# EAGLE design ArduinoNanoTemplateShield (EAGLE 7.2.0)
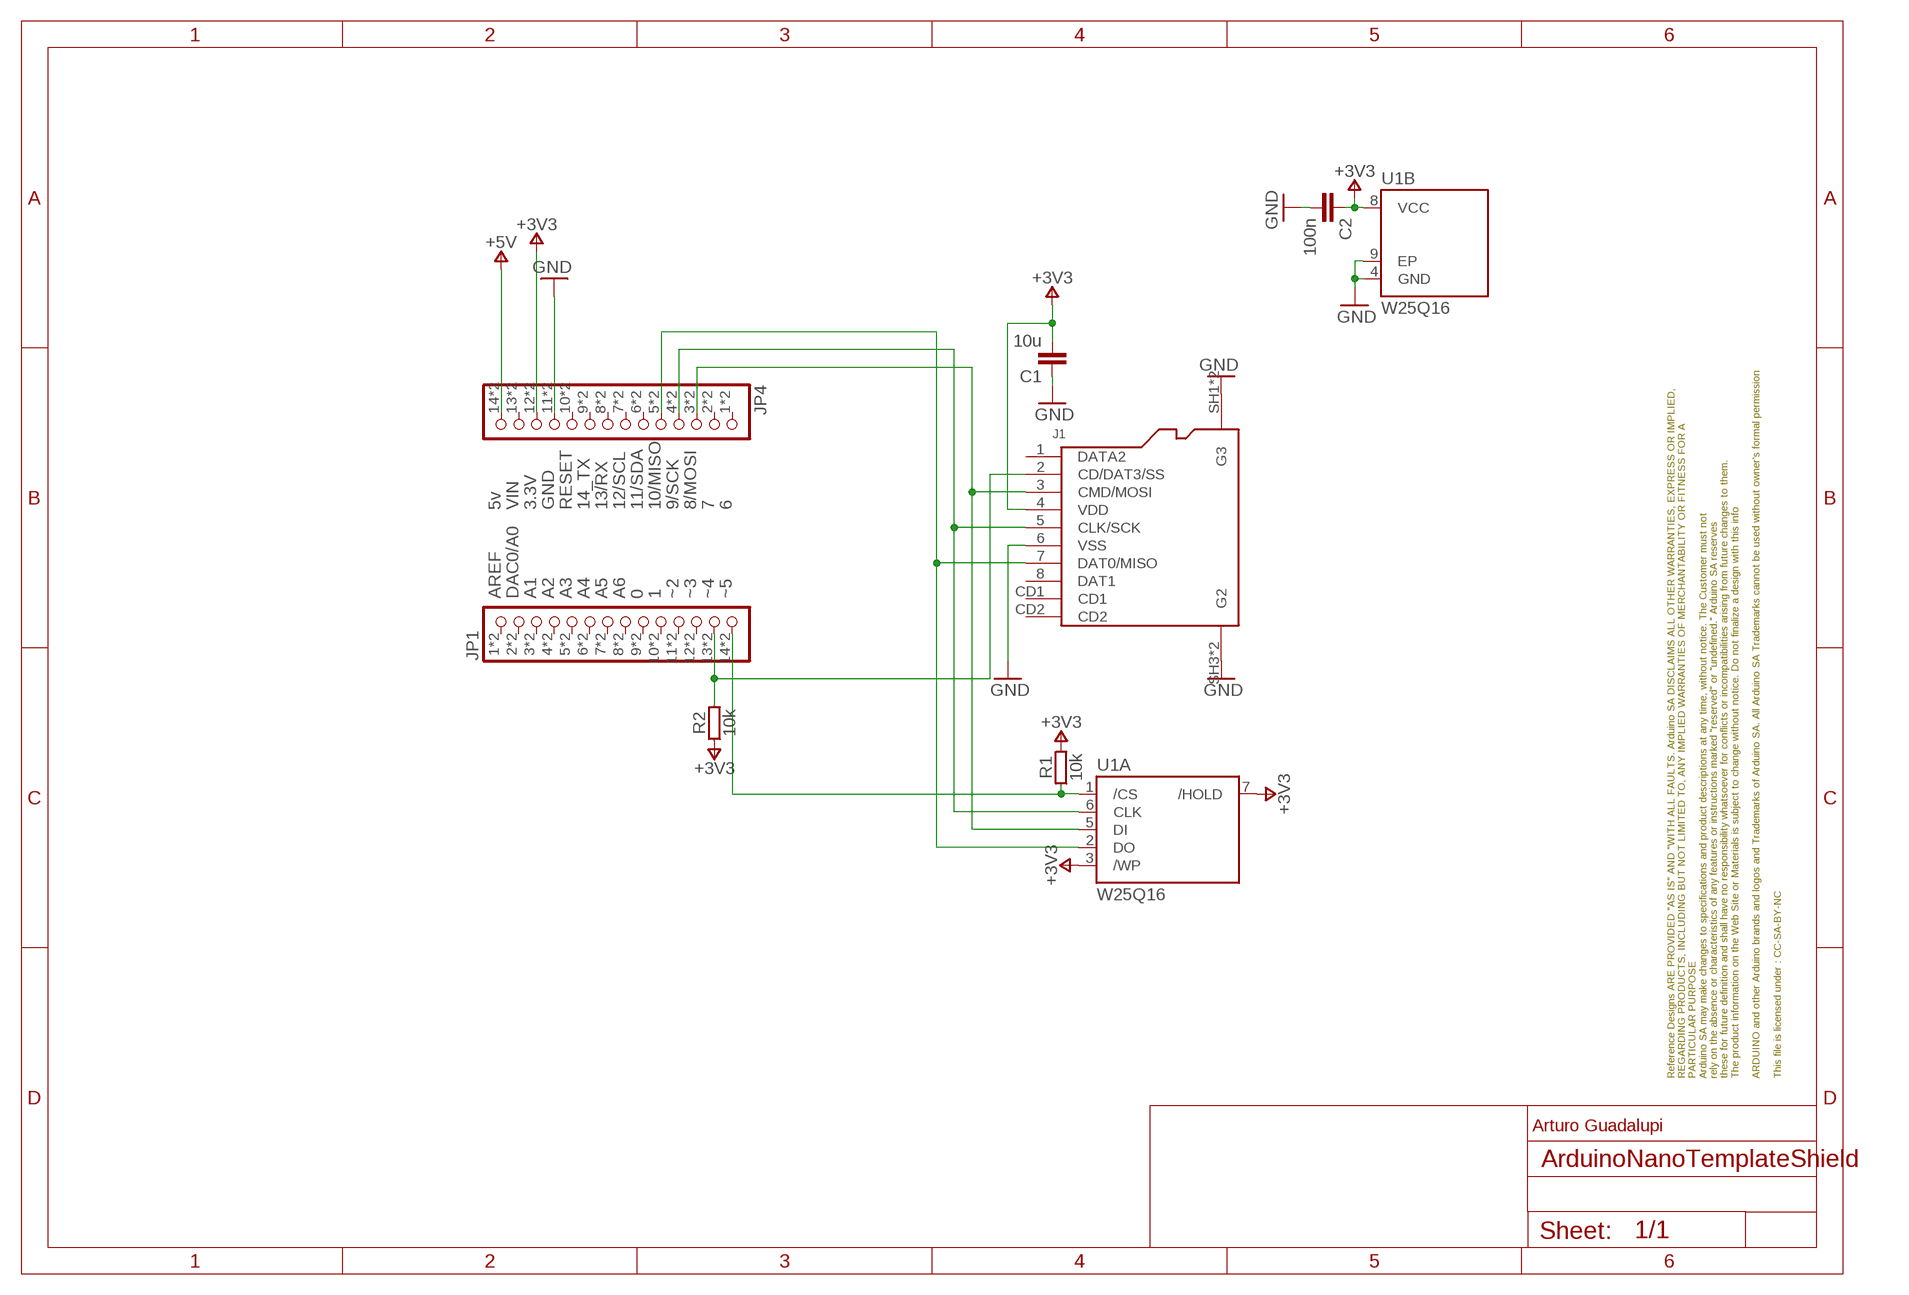
[diagram p0: schematic, sheet 1]

## Parts
C1  10u  C-10UF-0603  [0603-1608X90N]
C2  100n  C-100NF-0603  [0603-1608X90N]
FRAME1  DNP  A4L-LOC  [FRAME]
J1  -  SD_AMPHENOL  [AMPHENOL_114-00841-68]
JP1  -  PINHD-1X14TH-DOUBLE  [1X14-DOUBLE]
JP4  -  PINHD-1X14TH-DOUBLE  [1X14-DOUBLE]
R1  10k  R-10K-0603  [C0603]
R2  10k  R-10K-0603  [C0603]
U1  W25Q16  W25Q16DVZPIG  [SON9P127_500X600X80L60X41T340X400N]

## Nets
+3V3: C1.2 C2.1 J1.4(VDD) JP4.12 JP4.26 R1.2 R2.1 U1.3(A:/WP) U1.7(A:/HOLD) U1.8(B:VCC)
+5V: JP4.14 JP4.28
GND: C1.1 C2.2 J1.6(VSS) J1.SH1(G3) J1.SH2(G3) J1.SH3(G2) J1.SH4(G2) JP4.11 JP4.25 U1.4(B:GND) U1.9(B:EP)
N$1: JP1.14 JP1.28 R1.1 U1.1(A:/CS)
N$3: J1.3(CMD/MOSI) JP4.3 JP4.17 U1.5(A:DI)
N$4: J1.5(CLK/SCK) JP4.4 JP4.18 U1.6(A:CLK)
N$5: J1.7(DAT0/MISO) JP4.5 JP4.19 U1.2(A:DO)
N$77: J1.2(CD/DAT3/SS) JP1.13 JP1.27 R2.2
Unconnected: J1.1(DATA2) J1.8(DAT1) J1.CD1 J1.CD2 JP1.1 JP1.2 JP1.3 JP1.4 JP1.5 JP1.6 JP1.7 JP1.8 JP1.9 JP1.10 JP1.11 JP1.12 JP1.15 JP1.16 JP1.17 JP1.18 JP1.19 JP1.20 JP1.21 JP1.22 JP1.23 JP1.24 JP1.25 JP1.26 JP4.1 JP4.2 JP4.6 JP4.7 JP4.8 JP4.9 JP4.10 JP4.13 JP4.15 JP4.16 JP4.20 JP4.21 JP4.22 JP4.23 JP4.24 JP4.27

## Notes on the sheet
- 5v | VIN | 3.3V | GND | RESET | 14_TX | 13/RX | 12/SCL | 11/SDA | 10/MISO | 9/SCK | 8/MOSI | 7 | 6
- AREF | DAC0/A0 | A1 | A2 | A3 | A4 | A5 | A6 | 0 | 1 | ~2 | ~3 | ~4 | ~5
- Arturo Guadalupi

## Library data of the parts
C1 = Arduino-rcl:C: SMD Capacitor; CODE-BCE: -; CODE-BCMI: -; CODE-TK2: -; DATASHEET: http://www.murata.com/~/media/webrenewal/support/library/catalog/products/capacitor/mlcc/c02e.pdf; DISTRIBUTOR-LINK: http://www.digikey.com/product-search/en?keywords=490-10728-1-ND; DISTRIBUTOR-PN: 490-10728-1-ND; MANUFACTURER: Murata; MANUFACTURER-PN: GRM188R61C106KAALD
C2 = Arduino-rcl:C: SMD Capacitor; CODE-BCE: SP0015; CODE-BCMI: 0015; CODE-TK2: CL10B104KB8NNNC; DATASHEET: http://search.murata.co.jp/Ceramy/image/img/A01X/G101/ENG/GRM188R71C104KA01-01.pdf; DISTRIBUTOR-LINK: https://www.digikey.com/product-detail/en/murata-electronics-north-america/GRM188R71C104KA01D/490-1532-1-ND/587771; DISTRIBUTOR-PN: 490-1532-2-ND; MANUFACTURER: Murata; MANUFACTURER-PN: GRM188R71C104KA01D
FRAME1 = Arduino-utility:A4L-LOC: FRAME DIN A4, landscape with location and doc. field; CODE-ARDUINO: DNP; DATASHEET: DNP; DISTRIBUTOR-LINK: DNP; DISTRIBUTOR-PN: DNP; MANUFACTURER: DNP; MANUFACTURER-PN: DNP
J1 = Arduino-connectors:SD_AMPHENOL: Micro SD connector; CODE-BCE: -; CODE-TK2: -; DATASHEET: https://www.amphenolcanada.com/ProductSearch/drawings/AC/1140084168.pdf; DISTRIBUTOR-LINK: http://www.digikey.com/product-detail/en/amphenol-commercial-products/114-00841-68/114-00841-68-1-ND/2187101; DISTRIBUTOR-PN: 114-00841-68-1-ND; MANUFACTURER: Amphenol; MANUFACTURER-PN: 114-00841-68
JP1 JP4 = Arduino-connectors:PINHD-1X14: PIN HEADER; CODE-BCE: -; CODE-TK2: -; DATASHEET: -; DISTRIBUTOR-LINK: -; DISTRIBUTOR-PN: -; MANUFACTURER: ELDECO; MANUFACTURER-PN: FH254114DF08500T
R1 R2 = Arduino-rcl:R: SMD Resistor; CODE-BCE: SP0899; CODE-BCMI: 0899; CODE-TK2: -; DATASHEET: http://www.yageo.com/documents/recent/PYu-RC_Group_51_RoHS_L_8.pdf; DISTRIBUTOR-LINK: https://www.digikey.com/product-detail/en/yageo/RC0603JR-0710KL/311-10KGRCT-ND/729647; DISTRIBUTOR-PN: 311-10KGRCT-ND; MANUFACTURER: Yageo; MANUFACTURER-PN: RC0603JR-0710KL
U1 = Arduino-ICs:W25Q*: Flash; CODE-BCE: -; CODE-TK2: -; DATASHEET: https://www.winbond.com/resource-files/w25q16jv%20spi%20revd%2008122016.pdf; DISTRIBUTOR-LINK: https://www.digikey.com/product-detail/it/winbond-electronics/W25Q16JVZPIQ/W25Q16JVZPIQ-ND/6193770; DISTRIBUTOR-PN: W25Q16JVZPIQ-ND; MANUFACTURER: Winbond; MANUFACTURER-PN: W25Q16JVZPIQ

## Board
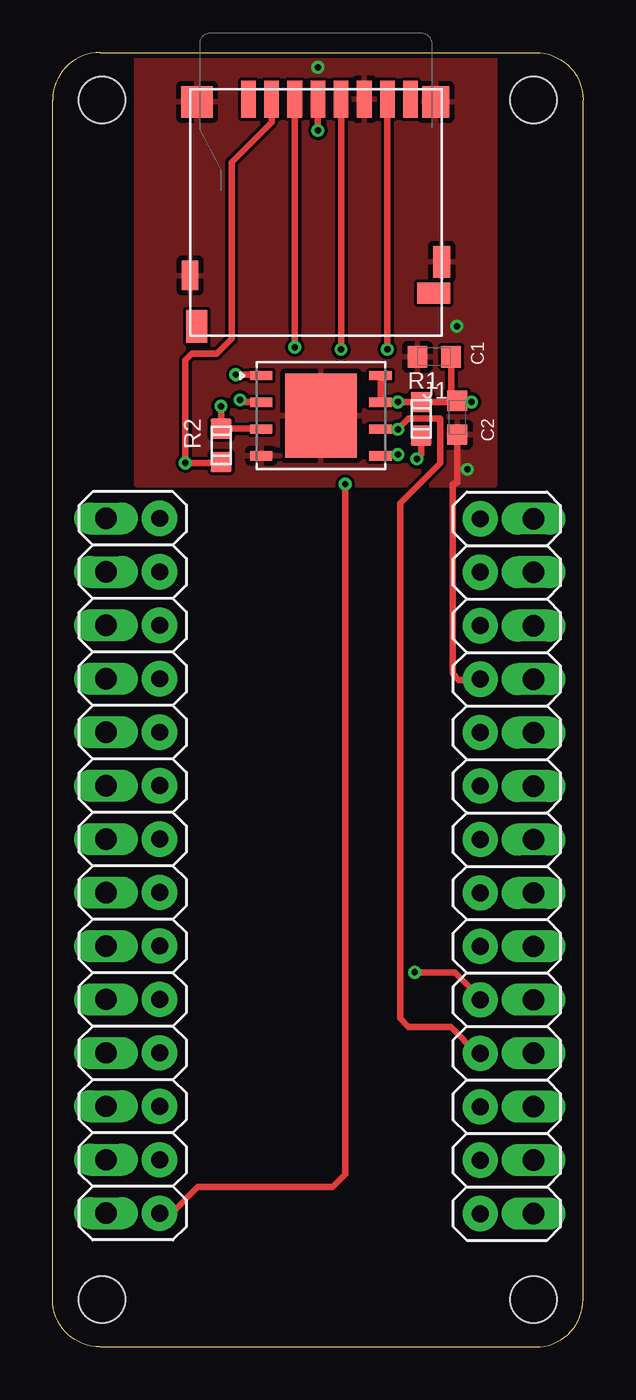
[diagram p1: board, top side]
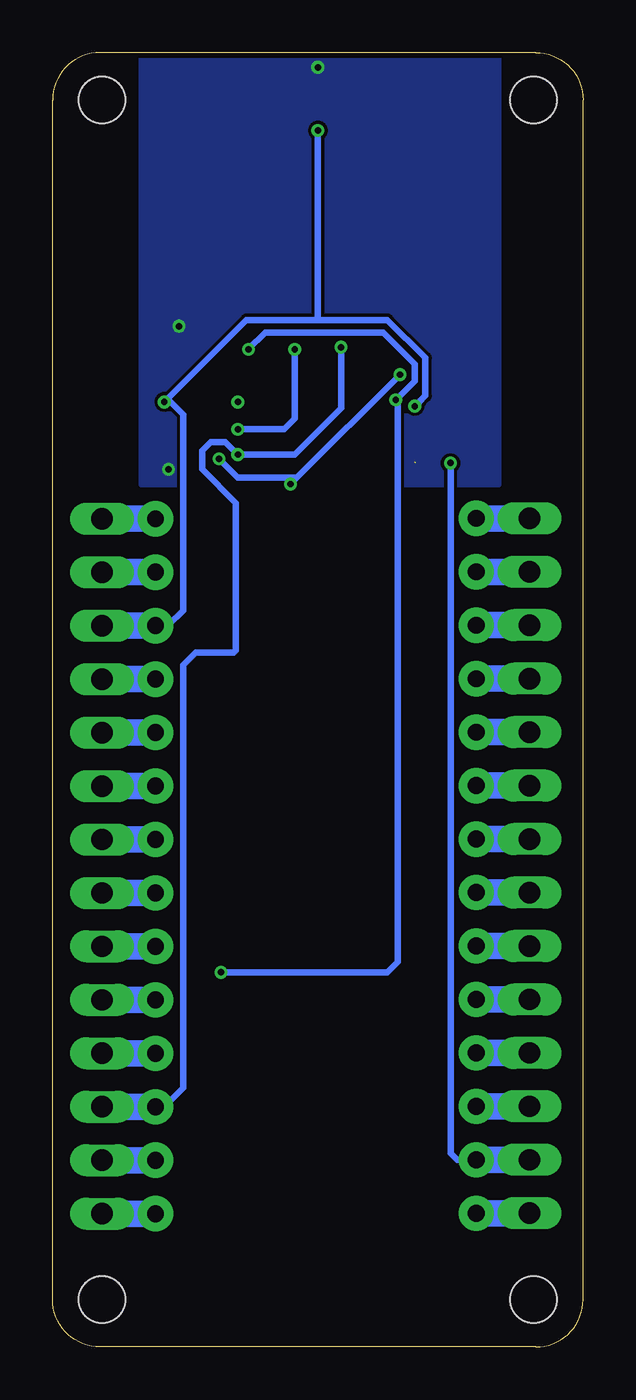
[diagram p2: board, bottom side, seen from below]

Size 25.2 x 61.5 mm. Coordinates in mm from the lower left corner, seen from the top.
Outline: 25.2,2.25 25.2,59.25 arc90 22.95,61.5 2.25,61.5 arc90 0,59.25 0,2.25 arc90 2.25,0 22.95,0 arc90 25.2,2.25
Copper layers (1*16): Top 0.035mm / dielectric 1.5mm / Bottom 0.035mm
Design rules "SeeedStudio_2layers": minimum track width 6mil, minimum drill 12mil, track to track 6mil, track to pad 6mil, pad to pad 6mil, via to via 6mil, smd to smd 0mil, copper to edge 10mil, drill to drill 10mil, minimum pad ring 10mil, minimum via ring 6mil, stop-mask expansion 2mil, vias tented up to drill 100mil, thermal gap 10mil
Holes 2.2 mm at 2.35,2.25 22.85,2.25 2.35,59.25 22.85,59.25

### Footprints (pad centres in the part's own frame; a part is rotated, then mirrored left to right if it is on the bottom)
0603-1608X90N = smd 0.95 x 1: 1 -0.8,0; 2 0.8,0
AMPHENOL_114-00841-68 = smd 0.7 x 1.75: 1 3.2,-5.888; 2 2.1,-5.888; 3 1,-5.888; 4 -0.1,-5.888; 5 -1.2,-5.888; 6 -2.3,-5.888; 7 -3.4,-5.888; 8 -4.5,-5.888 | smd 1 x 1.55: CD1 5.65,4.912 | smd 1.55 x 1: CD2 -5.602,3.337 | smd 1.3 x 1.5: SH1 -5.7,-5.76 | smd 1.5 x 1.5: SH2 5.65,-5.76 | smd 0.8 x 1.4: SH3 5.975,2.487 | smd 0.8 x 1.5: SH4 -5.975,1.837
1X14-DOUBLE = drill 1.016 long: 1 -16.51,0; 2 -13.97,0; 3 -11.43,0; 4 -8.89,0; 5 -6.35,0; 6 -3.81,0; 7 -1.27,0; 8 1.27,0; 9 3.81,0; 10 6.35,0; 11 8.89,0; 12 11.43,0; 13 13.97,0; 14 16.51,0 | drill 0.8 pad 1.676: 15 -16.51,2.54; 16 -13.97,2.54; 17 -11.43,2.54; 18 -8.89,2.54; 19 -6.35,2.54; 20 -3.81,2.54; 21 -1.27,2.54; 22 1.27,2.54; 23 3.81,2.54; 24 6.35,2.54; 25 8.89,2.54; 26 11.43,2.54; 27 13.97,2.54; 28 16.51,2.54
C0603 = smd 1 x 0.95: 1 0,0.8; 2 0,-0.8
SON9P127_500X600X80L60X41T340X400N = smd 0.44 x 1.06: 1 -1.905,-2.835; 2 -0.635,-2.835; 3 0.635,-2.835; 4 1.905,-2.835; 5 1.905,2.835; 6 0.635,2.835; 7 -0.635,2.835; 8 -1.905,2.835 | smd 4 x 3.4: 9 0,0

### Placement (x,y rotation side)
C1  18.13,47.05 0 top
C2  19.22,44.15 270 top
FRAME1  -40.1,-9.7 0 top  (outside the outline)
J1  12.5,53.4 180 top
JP1  2.54,22.86 270 top
JP4  22.85,22.84 90 top
R1  17.5,44.1 180 top
R2  8,42.84 0 top
U1  12.74,44.25 270 top

### Tracks (layer width: path | path; a pad name or v marks a point on that pad's centre or on a via)
+3V3  (via drill 0.3)
  Top 0.305: U1.3 9.88,43.64 R2.1 v8,44.7 | U1.8 U1.7 16.39,44.88 v16.4,44.9 R1.2 18.87,44.9 | 18.87,44.9 C2.1 18.93,44.96 C1.2 | 18.87,44.9 v19.9,44.9 | J1.4 v12.6,57.8
  Bottom 0.305: 7.7,45 v8,44.7 7.5,45.2 7.5,47 9.3,48.8 12.6,48.8 | JP4.26 20.28,34.3 19.7,34.3 19,35 19,44.3 19.6,44.9 v19.9,44.9 16,48.8 12.6,48.8 | v12.6,57.8 12.6,48.8
GND  (via drill 0.3)
  Top 0.305: C2.2 19.22,41.08 19,41 19,32 19.3,31.7 20.28,31.7 JP4.25
  other vias: 12.6,60.8 19.7,41.7 19.2,48.5
  pour Top: 21,62.3 21,40.98 4,40.98 4,62.3
  pour Bottom: 21,62.3 21,40.98 4,40.98 4,62.3
N$1  (via drill 0.3)
  Top 0.305: v8.7,46.2 9.86,46.2 U1.1 | R1.1 17.5,42.4 v17.3,42.2 | v13.9,41 13.9,8.2 13.3,7.6 6.9,7.6 5.65,6.35 JP1.28
  Bottom 0.305: 13.6,41.3 v8.7,46.2 | 13.6,41.3 16.4,41.3 v17.3,42.2 | 13.6,41.3 v13.9,41
N$3  (via drill 0.3)
  Top 0.305: J1.3 v11.5,47.5 | U1.5 16.34,42.34 v16.4,42.4
  Bottom 0.305: v11.5,47.5 11.5,44.6 13.7,42.4 v16.4,42.4 17,43 17.7,43 18.1,42.6 18.1,41.7 16.5,40.1 16.5,33.1 16.6,33 18.4,33 19,32.4 19,12.3 19.89,11.41 JP4.17
N$4  (via drill 0.3)
  Top 0.305: J1.5 v13.7,47.4 | U1.6 16.39,43.62 v16.4,43.6 16.9,44.1 18.4,44.1 18.4,42 16.5,40.1 16.5,15.6 16.9,15.2 18.9,15.2 20.15,13.95 JP4.18
  Bottom 0.305: v16.4,43.6 14.2,43.6 13.7,44.1 v13.7,47.4
N$5  (via drill 0.3)
  Top 0.305: J1.7 v15.9,47.4 | U1.2 9.02,44.88 v8.9,45 | JP4.19 20.31,16.59 19.1,17.8 v17.2,17.8
  Bottom 0.305: v15.9,47.4 15.1,48.2 9.5,48.2 8,46.7 8,45.9 v8.9,45 8.8,44.9 8.8,18.3 9.3,17.8 v17.2,17.8
N$77  (via drill 0.3)  (1 unrouted)
  Top 0.305: 7.96,42 v6.3,42 6.3,46.9 6.6,47.2 7.8,47.2 8.5,47.9 8.5,56.3 10.4,58.2 J1.2
  Bottom 0.305: v6.3,42 6.3,9.2 5.99,8.89 JP1.27

### Text on the board
Notes: Arturo Guadalupi